# Altium project BalanceCar.PrjPcb
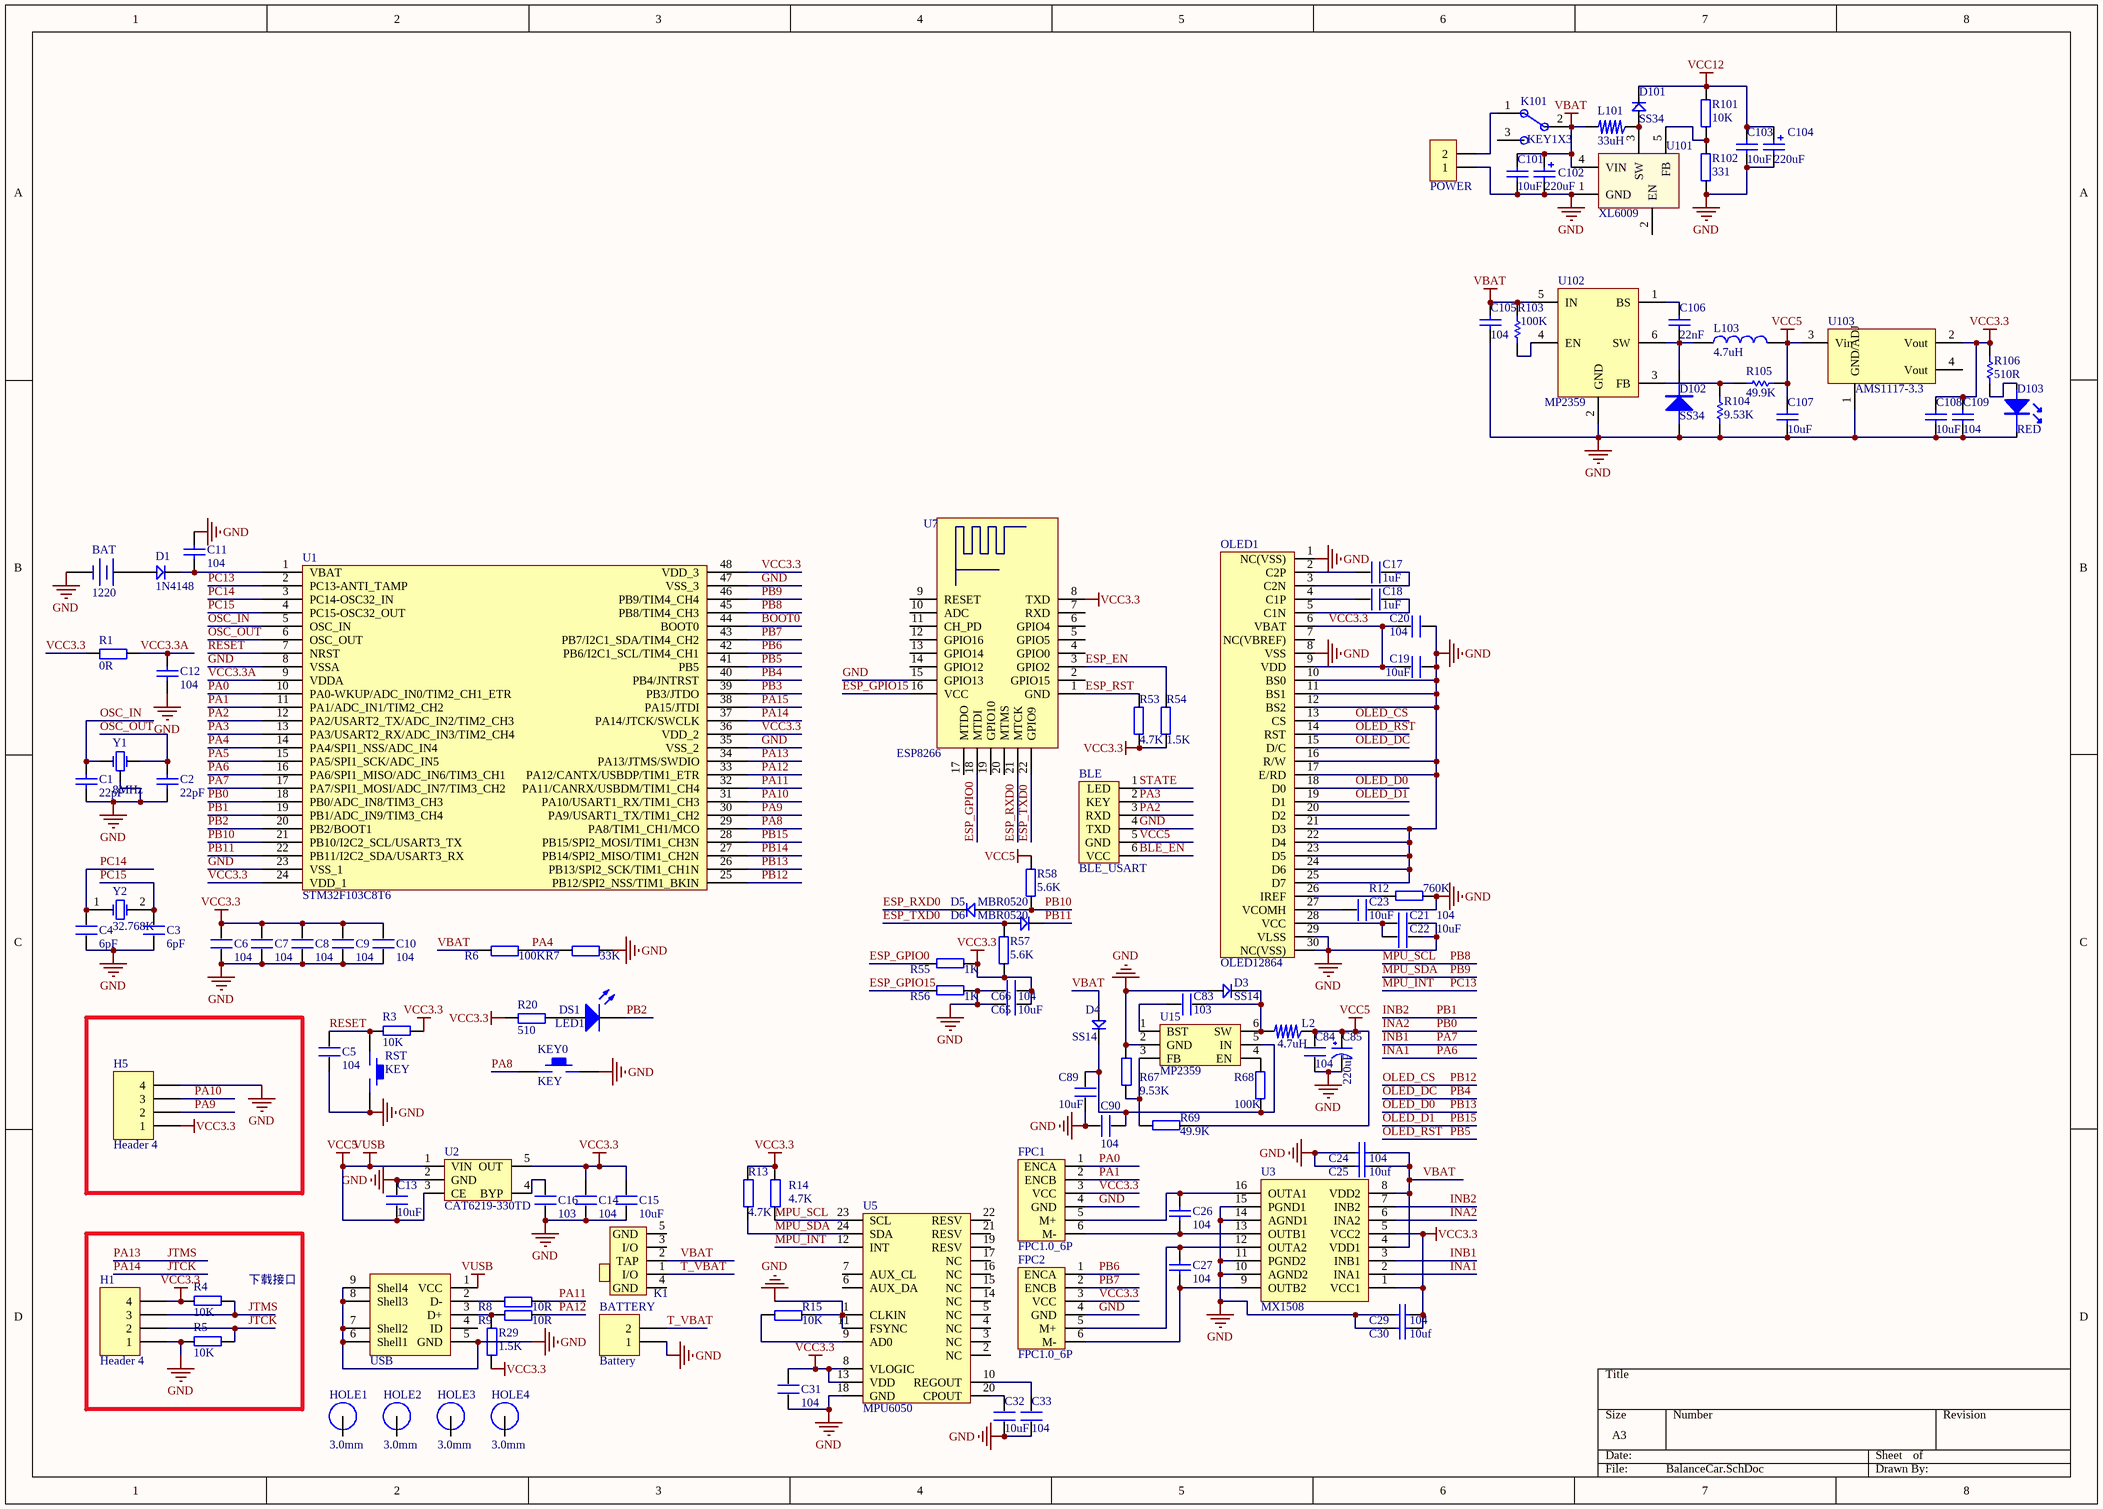
[diagram p0: BalanceCar.SchDoc]
1 sheet, 118 parts. Net scope: global (net labels, ports and power ports of the same name join across sheets).
Board file: BalanceCar.PcbDoc

## Sheet BalanceCar.SchDoc
size A3

### Parts
BAT  1220  [CR1220_B]
BATTERY  Battery  [HDR2.54-LI-2P]
BLE  BLE_USART  [HEAD6]
C1  22pF  [C 0603_M]
C2  22pF  [C 0603_M]
C3  6pF  [C 0603_M]
C4  6pF  [C 0603_M]
C5  104  [C 0603_M]
C6  104  [C 0603_M]
C7  104  [C 0603_M]
C8  104  [C 0603_M]
C9  104  [C 0603_M]
C10  104  [C 0603_M]
C11  104  [C 0603_M]
C12  104  [C 0603_M]
C13  10uF  [C 0603_M]
C14  104  [C 0603_M]
C15  10uF  [C 0603_M]
C16  103  [C 0603_M]
C17  1uF  [C 0603_M]
C18  1uF  [C 0603_M]
C19  10uF  [C 0603_M]
C20  104  [C 0603_M]
C21  10uF  [C 0603_M]
C22  104  [C 0603_M]
C23  10uF  [C 0603_M]
C24  104  [C 0603_M]
C25  10uf  [C 0603_M]
C26  104  [C 0603_M]
C27  104  [C 0603_M]
C29  104  [C 0603_M]
C30  10uf  [C 0603_M]
C31  104  [C 0603_M]
C32  10uF  [C 0603_M]
C33  104  [C 0603_M]
C65  10uF  [C 0603_M]
C66  104  [C 0603_M]
C83  103  [C 0603_M]
C84  104  [C 0603_M]
C85  220uF  [CM D(6.3*5.4)]
C89  10uF  [C 1206_L]
C90  104  [C 0603_M]
C101  value 10uF  [C 1210_M]  (hidden comment: Cap)
C102  value 220uF  [CAP 3.5*8*11.5 - BK]  (hidden comment: Cap Pol)
C103  value 10uF  [C 1210_M]  (hidden comment: Cap)
C104  value 220uF  [CAP 3.5*8*11.5 - BK]  (hidden comment: Cap Pol)
C105  value 104  [C 0603_M]  (hidden comment: Cap)
C106  value 22nF  [C 0603_M]  (hidden comment: Cap)
C107  value 10uF  [C 1210_M]  (hidden comment: Cap)
C108  value 10uF  [C 1210_M]  (hidden comment: Cap)
C109  value 104  [C 0603_M]  (hidden comment: Cap)
D1  1N4148  [MINI_MELF (LL34)]
D3  SS14  [SMA]
D4  SS14  [SMA]
D5  MBR0520  [SOD-123]
D6  MBR0520  [SOD-123]
D101  SS34  [SMA]
D102  SS34  [SMA]
D103  RED  [LED 0805R]
DS1  LED1  [LED 0603R]
FPC1  FPC1.0_6P  [FPC_1.0_6P]
FPC2  FPC1.0_6P  [FPC_1.0_6P]
H1  Header 4  [HDR2.54-LI-4P]
H5  Header 4  [HDR2.54-LI-4P]
HOLE1  value 3.0mm  [HOLE-M3]  (hidden comment: HOLE)
HOLE2  value 3.0mm  [HOLE-M3]  (hidden comment: HOLE)
HOLE3  value 3.0mm  [HOLE-M3]  (hidden comment: HOLE)
HOLE4  value 3.0mm  [HOLE-M3]  (hidden comment: HOLE)
K1  BUTTON_DIP3  [BTN8.8*4.6]  (value not drawn)
K101  KEY1X3  [PKEY]
KEY0  KEY  [TSW SMD-3*6*2.5]
L2  4.7uH  [CDRH73]
L101  33uH  [L_SOP74]
L103  value 4.7uH  [CD73]  (hidden comment: Inductance)
OLED1  OLED12864  [OLED12864]
POWER  SPKL  [XH2.54-2P_H]  (value not drawn)
R1  0R  [R 0603_M]
R3  10K  [R 0603_M]
R4  10K  [R 0603_M]
R5  10K  [R 0603_M]
R6  100K  [R 0603_M]
R7  33K  [R 0603_M]
R8  10R  [R 0603_M]
R9  10R  [R 0603_M]
R12  760K  [R 0603_M]
R13  4.7K  [R 0603_M]
R14  4.7K  [R 0603_M]
R15  10K  [R 0603_M]
R20  510  [R 0603_M]
R29  1.5K  [R 0603_M]
R53  4.7K  [R 0603_M]
R54  1.5K  [R 0603_M]
R55  1K  [R 0603_M]
R56  1K  [R 0603_M]
R57  5.6K  [R 0603_M]
R58  5.6K  [R 0603_M]
R67  9.53K  [R 0603_M]
R68  100K  [R 0603_M]
R69  49.9K  [R 0603_M]
R101  10K  [3296W]
R102  331  [R 0603_M]
R103  value 100K  [R 0603_M]  (hidden comment: Res1)
R104  value 9.53K  [R 0603_M]  (hidden comment: Res1)
R105  value 49.9K  [R 0603_M]  (hidden comment: Res1)
R106  value 510R  [R 0603_M]  (hidden comment: Res1)
RST  KEY  [TSW SMD-3*6*2.5]
U1  STM32F103C8T6  [LQFP-48PIN]
U2  CAT6219-330TD  [SOT23-5M]
U3  MX1508  [SOP16N_M]
U5  MPU6050  [QFN24 4x4_N]
U7  ESP8266  [ESP_12E]
U15  MP2359  [SOT23-6M]
U101  XL6009  [TO-263-5]
U102  MP2359  [SOT23-6M]
U103  AMS1117-3.3  [SOT223_N]
USB  J-MICRO-USB-5S  [USB-AB-5S]  (value not drawn)
Y1  8MHz  [Y-XTAL-3215-3P]
Y2  32.768K  [OSC 3215-2P]

### Blocks framed on the sheet
下载接口: H1 R4 R5

### Nets
GND: BAT.2(DC-) BATTERY.1 BLE.4(TXD) C1.1 C2.1 C3.1 C4.1 C5.1 C6.1 C7.1 C8.1 C9.1 C10.1 C11.2 C12.1 C13.2 C14.1 C15.1 C16.1 C19.1 C20.1 C21.1 C22.1 C23.1 C24.1 C25.1 C29.1 C30.1 C31.1 C32.1 C33.1 C65.1 C66.1 C84.1 C85.2(GND) C89.1 C90.1 C101.2 C102.2 C103.2 C104.2 C105.2 C107.1 C108.1 C109.2 D3.1 D102.1(A) D103.2 FPC1.4(GND) FPC2.4(GND) H1.1 H5.4 KEY0.2 OLED1.1(NC(VSS)) OLED1.8(VSS) OLED1.10(BS0) OLED1.11(BS1) OLED1.12(BS2) OLED1.16(R/W) OLED1.17(E/RD) OLED1.21(D3) OLED1.22(D4) OLED1.23(D5) OLED1.24(D6) OLED1.25(D7) OLED1.29(VLSS) OLED1.30(NC(VSS)) POWER.1 R5.2 R7.2 R12.1 R15.2 R56.1 R67.2 R102.2 R104.2 RST.2 U1.8(VSSA) U1.23(VSS_1) U1.35(VSS_2) U1.47(VSS_3) U2.2(GND) U3.10(AGND2) U3.11(PGND2) U3.14(AGND1) U3.15(PGND1) U5.1(CLKIN) U5.11(FSYNC) U5.18(GND) U7.15(GPIO13) U15.2(GND) U101.1(GND) U102.2(GND) U103.1(GND/ADJ) USB.5(GND) USB.6(Shell1) USB.7(Shell2) USB.8(Shell3) USB.9(Shell4) Y1.2(GND)
VBAT: C24.2 C25.2 C101.1 C102.1 C105.1 D4.1 K1.2(TAP) K101.2 L101.2 R6.1 R103.2 U3.4(VDD1) U3.8(VDD2) U101.4(VIN) U102.5(IN)
VCC3.3: C6.2 C7.2 C8.2 C9.2 C10.2 C14.2 C15.2 C19.2 C20.2 C29.2 C30.2 C31.2 C65.2 C66.2 C108.2 C109.1 FPC1.3(VCC) FPC2.3(VCC) H1.4 H5.1 OLED1.6(VBAT) OLED1.9(VDD) R1.1 R3.1 R4.2 R13.2 R14.2 R20.1 R29.1 R53.2 R54.2 R55.1 R57.2 R106.1 U1.24(VDD_1) U1.36(VDD_2) U1.48(VDD_3) U2.5(OUT) U3.1(VCC1) U3.5(VCC2) U5.8(VLOGIC) U5.13(VDD) U7.8(TXD) U103.2(Vout)
VCC5: BLE.5(GND) C13.1 C84.2 C85.1(VCC) C107.2 L2.1 L103.2 R58.1 R69.1 R105.1 U2.1(VIN) U2.3(CE) U103.3(Vin) USB.1(VCC)  [also labelled VUSB]
VCC12: C103.1 C104.1 D101.2 R101.1
BLE_EN: BLE.6(VCC)
BOOT0: U1.44(BOOT0)
ESP_EN: R54.1 U7.3(GPIO2)
ESP_GPIO0: R55.2 U7.18(MTDI)
ESP_GPIO15: R56.2 U7.16(VCC)
ESP_RST: R53.1 U7.1(GND)
ESP_RXD0: D5.2 U7.21(MTCK)
ESP_TXD0: D6.1 R57.1 U7.22(GPIO9)
INA1: U1.16(PA6/SPI1_MISO/ADC_IN6/TIM3_CH1) U3.2(INA1)  [also labelled PA6]
INA2: U1.18(PB0/ADC_IN8/TIM3_CH3) U3.6(INA2)  [also labelled PB0]
INB1: U1.17(PA7/SPI1_MOSI/ADC_IN7/TIM3_CH2) U3.3(INB1)  [also labelled PA7]
INB2: U1.19(PB1/ADC_IN9/TIM3_CH4) U3.7(INB2)  [also labelled PB1]
JTCK: H1.2 R5.1 U1.37(PA14/JTCK/SWCLK)  [also labelled PA14]
JTMS: H1.3 R4.1 U1.34(PA13/JTMS/SWDIO)  [also labelled PA13]
MPU_INT: U1.2(PC13-ANTI_TAMP) U5.12(INT)  [also labelled PC13]
MPU_SCL: R14.1 U1.45(PB8/TIM4_CH3) U5.23(SCL)  [also labelled PB8]
MPU_SDA: R13.1 U1.46(PB9/TIM4_CH4) U5.24(SDA)  [also labelled PB9]
OLED_CS: OLED1.13(CS) U1.25(PB12/SPI2_NSS/TIM1_BKIN)  [also labelled PB12]
OLED_D0: OLED1.18(D0) U1.26(PB13/SPI2_SCK/TIM1_CH1N)  [also labelled PB13]
OLED_D1: OLED1.19(D1) U1.28(PB15/SPI2_MOSI/TIM1_CH3N)  [also labelled PB15]
OLED_DC: OLED1.15(D/C) U1.40(PB4/JNTRST)  [also labelled PB4]
OLED_RST: OLED1.14(RST) U1.41(PB5)  [also labelled PB5]
OSC_IN: C1.2 U1.5(OSC_IN) Y1.1(OSC1)
OSC_OUT: C2.2 U1.6(OSC_OUT) Y1.3(OSC2)
PA0: FPC1.1(ENCA) U1.10(PA0-WKUP/ADC_IN0/TIM2_CH1_ETR)
PA1: FPC1.2(ENCB) U1.11(PA1/ADC_IN1/TIM2_CH2)
PA2: BLE.3(RXD) U1.12(PA2/USART2_TX/ADC_IN2/TIM2_CH3)
PA3: BLE.2(KEY) U1.13(PA3/USART2_RX/ADC_IN3/TIM2_CH4)
PA4: R6.2 R7.1 U1.14(PA4/SPI1_NSS/ADC_IN4)
PA5: U1.15(PA5/SPI1_SCK/ADC_IN5)
PA8: KEY0.1 U1.29(PA8/TIM1_CH1/MCO)
PA9: H5.2 U1.30(PA9/USART1_TX/TIM1_CH2)
PA10: H5.3 U1.31(PA10/USART1_RX/TIM1_CH3)
PA11: R8.2 U1.32(PA11/CANRX/USBDM/TIM1_CH4)
PA12: R9.2 U1.33(PA12/CANTX/USBDP/TIM1_ETR)
PA15: U1.38(PA15/JTDI)
PB2: DS1.2(K) U1.20(PB2/BOOT1)
PB3: U1.39(PB3/JTDO)
PB6: FPC2.1(ENCA) U1.42(PB6/I2C1_SCL/TIM4_CH1)
PB7: FPC2.2(ENCB) U1.43(PB7/I2C1_SDA/TIM4_CH2)
PB10: D5.1 R58.2 U1.21(PB10/I2C2_SCL/USART3_TX)
PB11: D6.2 U1.22(PB11/I2C2_SDA/USART3_RX)
PB14: U1.27(PB14/SPI2_MISO/TIM1_CH2N)
PC14: C4.2 U1.3(PC14-OSC32_IN) Y2.1(OSC1)
PC15: C3.2 U1.4(PC15-OSC32_OUT) Y2.2(OSC2)
RESET: C5.2 R3.2 RST.1 U1.7(NRST)
STATE: BLE.1(LED)
T_VBAT: BATTERY.2 K1.1(I/O)
VCC3.3A: C12.2 R1.2 U1.9(VDDA)
NetBAT_1: BAT.1(DC+) D1.1
NetC11_1: C11.1 D1.2 U1.1(VBAT)
NetC16_2: C16.2 U2.4(BYP)
NetC17_1: C17.1 OLED1.3(C2N)
NetC17_2: C17.2 OLED1.2(C2P)
NetC18_1: C18.1 OLED1.5(C1N)
NetC18_2: C18.2 OLED1.4(C1P)
NetC21_2: C21.2 C22.2 OLED1.28(VCC)
NetC23_2: C23.2 OLED1.27(VCOMH)
NetC26_1: C26.1 FPC1.6(M-) U3.13(OUTB1)
NetC26_2: C26.2 FPC1.5(M+) U3.16(OUTA1)
NetC27_1: C27.1 FPC2.6(M-) U3.9(OUTB2)
NetC27_2: C27.2 FPC2.5(M+) U3.12(OUTA2)
NetC32_2: C32.2 U5.20(CPOUT)
NetC33_2: C33.2 U5.10(REGOUT)
NetC83_1: C83.1 U15.1(BST)
NetC83_2: C83.2 D3.2 L2.2 U15.6(SW)
NetC89_2: C89.2 C90.2 D4.2 R68.2 U15.5(IN)
NetC106_1: C106.1 U102.1(BS)
NetC106_2: C106.2 D102.2(K) L103.1 U102.6(SW)
NetD101_1: D101.1 L101.1 U101.3(SW)
NetD103_1: D103.1 R106.2
NetDS1_1: DS1.1(A) R20.2
NetK101_1: K101.1 POWER.2
NetOLED1_26: OLED1.26(IREF) R12.2
NetR8_1: R8.1 USB.2(D-)
NetR9_1: R9.1 R29.2 USB.3(D+)
NetR15_1: R15.1 U5.9(AD0)
NetR67_1: R67.1 R69.2 U15.3(FB)
NetR68_1: R68.1 U15.4(EN)
NetR101_2: R101.2 R102.1 U101.5(FB)
NetR103_1: R103.1 U102.4(EN)
NetR104_1: R104.1 R105.2 U102.3(FB)

Not connected (* = marked no-connect by the designer): HOLE1 1; HOLE2 1; HOLE3 1; HOLE4 1; K1 3(I/O) 4(GND) 5(GND); K101 3; OLED1 7(NC(VBREF)) 20(D2); U5 2(NC) 3(NC) 4(NC) 5(NC) 6(AUX_DA) 7(AUX_CL) 14(NC) 15(NC) 16(NC) 17(NC) 19(RESV) 21(RESV) 22(RESV); U7 2(GPIO15) 4(GPIO0) 5(GPIO5) 6(GPIO4) 7(RXD) 9(RESET) 10(ADC) 11(CH_PD) 12(GPIO16) 13(GPIO14) 14(GPIO12) 17(MTDO) 19(GPIO10) 20(MTMS); U101 2(EN); U103 4(Vout); USB 4(ID)

### Library data of the parts
BAT = CR-3V: 微型电池; 版权归属: 源创客; BOM名称: 微型电池; 学习资源: www.ooocke.com
BATTERY = Header 2: Header, 2-Pin; LatestRevisionDate: 17-Jul-2002; LatestRevisionNote: Re-released for DXP Platform.; Publisher: Altium Limited
BLE = ATK-HC05
C1 C2 C11 C12 C24-C27 C29 C30 C85 = CAP
C3-C10 C13-C23 C31-C33 C65 C66 C83 C84 C89 C90 = C
C101 C103 C107 C108 = Cap_1: Capacitor; Published: 8-Jun-2000; LatestRevisionDate: 17-Jul-2002; LatestRevisionNote: Re-released for DXP Platform.; Publisher: Altium Limited
C102 C104 = Cap Pol_1: Polarized Capacitor (Radial); Published: 8-Jun-2000; LatestRevisionDate: 17-Jul-2002; LatestRevisionNote: Re-released for DXP Platform.; Publisher: Altium Limited
C105 C106 C109 = Cap: Capacitor; Published: 8-Jun-2000; LatestRevisionDate: 17-Jul-2002; LatestRevisionNote: Re-released for DXP Platform.; Publisher: Altium Limited
D1 D101 = D
D3-D6 = D: 1N4148
D102 = DIODE_1: Diode
D103 = LED
DS1 = LED2: Typical RED, GREEN, YELLOW, AMBER GaAs LED; Published: 8-Jun-2000; LatestRevisionDate: 17-Jul-2002; LatestRevisionNote: Re-released for DXP Platform.; PackageDocument: Feb-2002; PackageReference: 3.2X1.6X1.1; Publisher: Altium Limited
FPC1 FPC2 = FPC
H1 H5 = Header 4: Header, 4-Pin; LatestRevisionDate: 17-Jul-2002; LatestRevisionNote: Re-released for DXP Platform.; Publisher: Altium Limited
K1 = BUTTON_DIP3: 拨动开关SS-12F44
K101 = PKEY
KEY0 RST = KEY_M
L2 L101 = L_SOP
POWER = Header 2: 2P接插件; 版权归属: 源创客; BOM名称: 2P接插件; 学习资源: www.ooocke.com
R1 R3-R9 R12-R15 R20 R29 R53-R58 R67-R69 R101 R102 = R
R103-R106 = Res1: Resistor; Published: 8-Jun-2000; LatestRevisionDate: 17-Jul-2002; LatestRevisionNote: Re-released for DXP Platform.; Publisher: Altium Limited
U1 = U-STM32F103C8T6
U2 = CAT6219-330TD: 3.3V 500mA LDO
U3 = Component_1
U5 = MPU6050: 9轴运动处理传感器
U15 = MP2359: DC DC Step Down IC
U102 = MP2359: MP2359DJ-LF-Z
U103 = AMS1117-3.3: LDO 3.3V
USB = J-MICRO-USB-5S: Micro USB 5.9有柱脚长1.25加长针
Y1 = Y-3215-8M: XTAL,3215,8MHz
Y2 = XTAL: Crystal Oscillator; Published: 8-Jun-2000; LatestRevisionDate: 17-Jul-2002; LatestRevisionNote: Re-released for DXP Platform.; Publisher: Altium Limited